# EAGLE design yacc2buss (EAGLE 7.6.0)
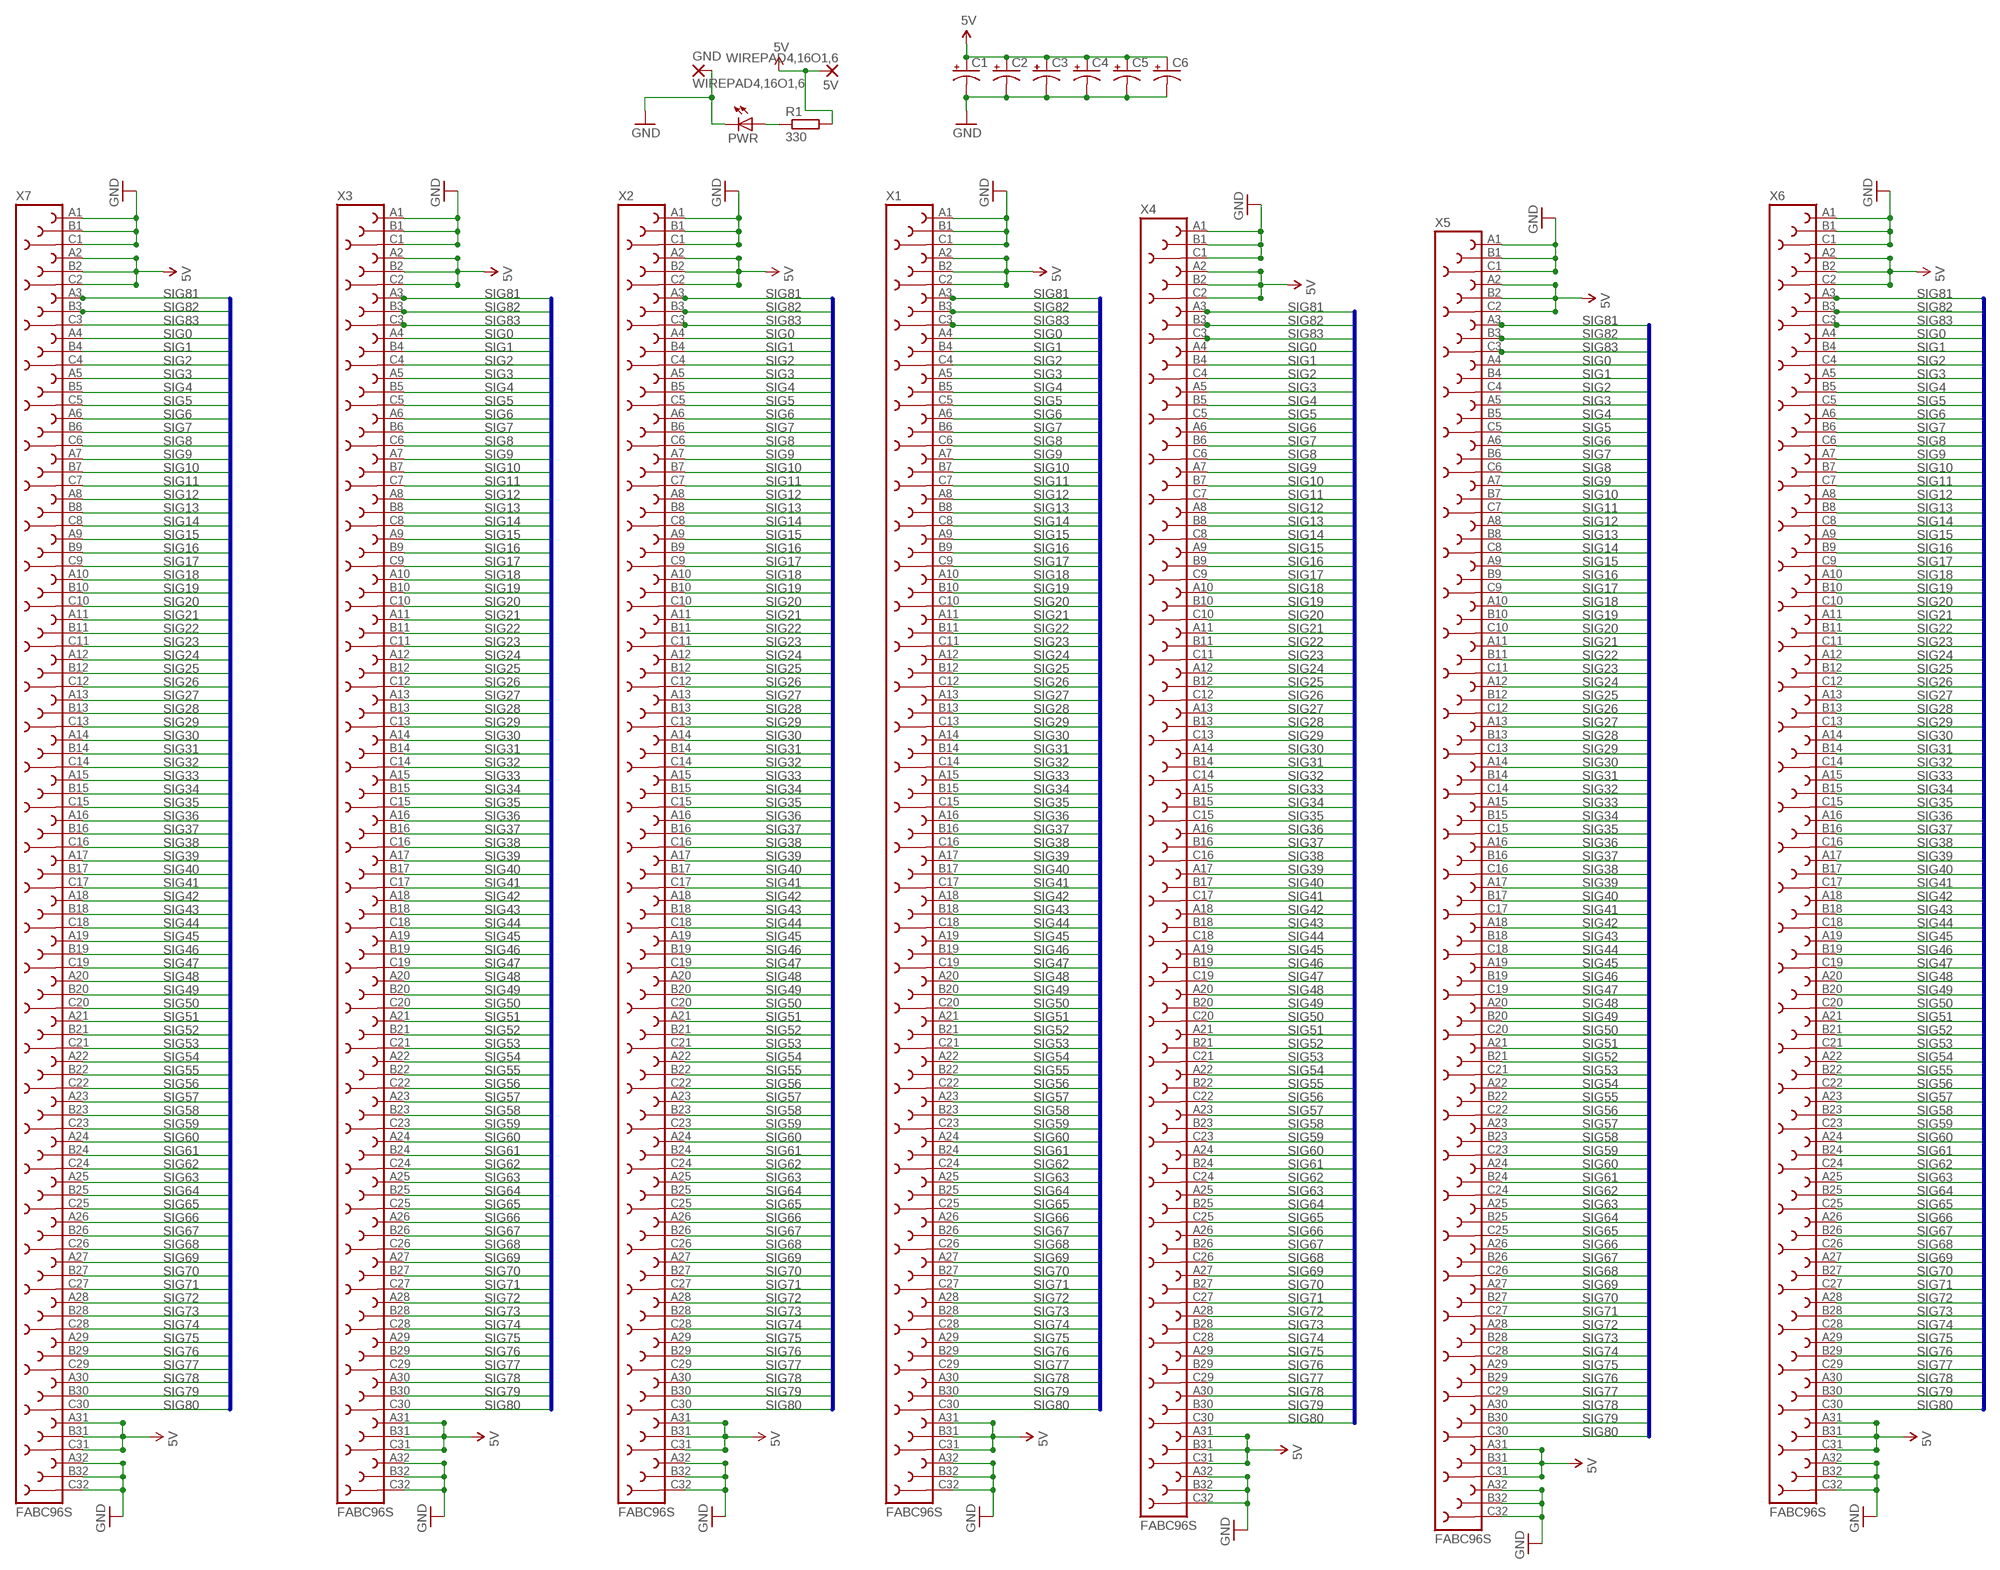
[diagram p0: schematic, sheet 1]

## Parts
5V  WIREPAD4,16O1,6  [4,16O1,6]
C1  CPOL-USE5-6  [E5-6]
C2  CPOL-USE5-6  [E5-6]
C3  CPOL-USE5-6  [E5-6]
C4  CPOL-USE5-6  [E5-6]
C5  CPOL-USE5-6  [E5-6]
C6  CPOL-USE5-6  [E5-6]
GND  WIREPAD4,16O1,6  [4,16O1,6]
PWR  LED5MM  [LED5MM]
R1  330  R0207/10  [0207/10]
X1  FABC96S  [FABC96S]
X2  FABC96S  [FABC96S]
X3  FABC96S  [FABC96S]
X4  FABC96S  [FABC96S]
X5  FABC96S  [FABC96S]
X6  FABC96S  [FABC96S]
X7  FABC96S  [FABC96S]

## Nets
5V [5V]: 5V.1(P) C1.+ C2.+ C3.+ C4.+ C5.+ C6.+ R1.2 X1.A2 X1.A31 X1.B2 X1.B31 X1.C2 X1.C31 X2.A2 X2.A31 X2.B2 X2.B31 X2.C2 X2.C31 X3.A2 X3.A31 X3.B2 X3.B31 X3.C2 X3.C31 X4.A2 X4.A31 X4.B2 X4.B31 X4.C2 X4.C31 X5.A2 X5.A31 X5.B2 X5.B31 X5.C2 X5.C31 X6.A2 X6.A31 X6.B2 X6.B31 X6.C2 X6.C31 X7.A2 X7.A31 X7.B2 X7.B31 X7.C2 X7.C31
GND [GND]: C1.- C2.- C3.- C4.- C5.- C6.- GND.1(P) PWR.K(C) X1.A1 X1.A32 X1.B1 X1.B32 X1.C1 X1.C32 X2.A1 X2.A32 X2.B1 X2.B32 X2.C1 X2.C32 X3.A1 X3.A32 X3.B1 X3.B32 X3.C1 X3.C32 X4.A1 X4.A32 X4.B1 X4.B32 X4.C1 X4.C32 X5.A1 X5.A32 X5.B1 X5.B32 X5.C1 X5.C32 X6.A1 X6.A32 X6.B1 X6.B32 X6.C1 X6.C32 X7.A1 X7.A32 X7.B1 X7.B32 X7.C1 X7.C32
N$2: PWR.A R1.1
SIG0: X1.A4 X2.A4 X3.A4 X4.A4 X5.A4 X6.A4 X7.A4
SIG1: X1.B4 X2.B4 X3.B4 X4.B4 X5.B4 X6.B4 X7.B4
SIG2: X1.C4 X2.C4 X3.C4 X4.C4 X5.C4 X6.C4 X7.C4
SIG3: X1.A5 X2.A5 X3.A5 X4.A5 X5.A5 X6.A5 X7.A5
SIG4: X1.B5 X2.B5 X3.B5 X4.B5 X5.B5 X6.B5 X7.B5
SIG5: X1.C5 X2.C5 X3.C5 X4.C5 X5.C5 X6.C5 X7.C5
SIG6: X1.A6 X2.A6 X3.A6 X4.A6 X5.A6 X6.A6 X7.A6
SIG7: X1.B6 X2.B6 X3.B6 X4.B6 X5.B6 X6.B6 X7.B6
SIG8: X1.C6 X2.C6 X3.C6 X4.C6 X5.C6 X6.C6 X7.C6
SIG9: X1.A7 X2.A7 X3.A7 X4.A7 X5.A7 X6.A7 X7.A7
SIG10: X1.B7 X2.B7 X3.B7 X4.B7 X5.B7 X6.B7 X7.B7
SIG11: X1.C7 X2.C7 X3.C7 X4.C7 X5.C7 X6.C7 X7.C7
SIG12: X1.A8 X2.A8 X3.A8 X4.A8 X5.A8 X6.A8 X7.A8
SIG13: X1.B8 X2.B8 X3.B8 X4.B8 X5.B8 X6.B8 X7.B8
SIG14: X1.C8 X2.C8 X3.C8 X4.C8 X5.C8 X6.C8 X7.C8
SIG15: X1.A9 X2.A9 X3.A9 X4.A9 X5.A9 X6.A9 X7.A9
SIG16: X1.B9 X2.B9 X3.B9 X4.B9 X5.B9 X6.B9 X7.B9
SIG17: X1.C9 X2.C9 X3.C9 X4.C9 X5.C9 X6.C9 X7.C9
SIG18: X1.A10 X2.A10 X3.A10 X4.A10 X5.A10 X6.A10 X7.A10
SIG19: X1.B10 X2.B10 X3.B10 X4.B10 X5.B10 X6.B10 X7.B10
SIG20: X1.C10 X2.C10 X3.C10 X4.C10 X5.C10 X6.C10 X7.C10
SIG21: X1.A11 X2.A11 X3.A11 X4.A11 X5.A11 X6.A11 X7.A11
SIG22: X1.B11 X2.B11 X3.B11 X4.B11 X5.B11 X6.B11 X7.B11
SIG23: X1.C11 X2.C11 X3.C11 X4.C11 X5.C11 X6.C11 X7.C11
SIG24: X1.A12 X2.A12 X3.A12 X4.A12 X5.A12 X6.A12 X7.A12
SIG25: X1.B12 X2.B12 X3.B12 X4.B12 X5.B12 X6.B12 X7.B12
SIG26: X1.C12 X2.C12 X3.C12 X4.C12 X5.C12 X6.C12 X7.C12
SIG27: X1.A13 X2.A13 X3.A13 X4.A13 X5.A13 X6.A13 X7.A13
SIG28: X1.B13 X2.B13 X3.B13 X4.B13 X5.B13 X6.B13 X7.B13
SIG29: X1.C13 X2.C13 X3.C13 X4.C13 X5.C13 X6.C13 X7.C13
SIG30: X1.A14 X2.A14 X3.A14 X4.A14 X5.A14 X6.A14 X7.A14
SIG31: X1.B14 X2.B14 X3.B14 X4.B14 X5.B14 X6.B14 X7.B14
SIG32: X1.C14 X2.C14 X3.C14 X4.C14 X5.C14 X6.C14 X7.C14
SIG33: X1.A15 X2.A15 X3.A15 X4.A15 X5.A15 X6.A15 X7.A15
SIG34: X1.B15 X2.B15 X3.B15 X4.B15 X5.B15 X6.B15 X7.B15
SIG35: X1.C15 X2.C15 X3.C15 X4.C15 X5.C15 X6.C15 X7.C15
SIG36: X1.A16 X2.A16 X3.A16 X4.A16 X5.A16 X6.A16 X7.A16
SIG37: X1.B16 X2.B16 X3.B16 X4.B16 X5.B16 X6.B16 X7.B16
SIG38: X1.C16 X2.C16 X3.C16 X4.C16 X5.C16 X6.C16 X7.C16
SIG39: X1.A17 X2.A17 X3.A17 X4.A17 X5.A17 X6.A17 X7.A17
SIG40: X1.B17 X2.B17 X3.B17 X4.B17 X5.B17 X6.B17 X7.B17
SIG41: X1.C17 X2.C17 X3.C17 X4.C17 X5.C17 X6.C17 X7.C17
SIG42: X1.A18 X2.A18 X3.A18 X4.A18 X5.A18 X6.A18 X7.A18
SIG43: X1.B18 X2.B18 X3.B18 X4.B18 X5.B18 X6.B18 X7.B18
SIG44: X1.C18 X2.C18 X3.C18 X4.C18 X5.C18 X6.C18 X7.C18
SIG45: X1.A19 X2.A19 X3.A19 X4.A19 X5.A19 X6.A19 X7.A19
SIG46: X1.B19 X2.B19 X3.B19 X4.B19 X5.B19 X6.B19 X7.B19
SIG47: X1.C19 X2.C19 X3.C19 X4.C19 X5.C19 X6.C19 X7.C19
SIG48: X1.A20 X2.A20 X3.A20 X4.A20 X5.A20 X6.A20 X7.A20
SIG49: X1.B20 X2.B20 X3.B20 X4.B20 X5.B20 X6.B20 X7.B20
SIG50: X1.C20 X2.C20 X3.C20 X4.C20 X5.C20 X6.C20 X7.C20
SIG51: X1.A21 X2.A21 X3.A21 X4.A21 X5.A21 X6.A21 X7.A21
SIG52: X1.B21 X2.B21 X3.B21 X4.B21 X5.B21 X6.B21 X7.B21
SIG53: X1.C21 X2.C21 X3.C21 X4.C21 X5.C21 X6.C21 X7.C21
SIG54: X1.A22 X2.A22 X3.A22 X4.A22 X5.A22 X6.A22 X7.A22
SIG55: X1.B22 X2.B22 X3.B22 X4.B22 X5.B22 X6.B22 X7.B22
SIG56: X1.C22 X2.C22 X3.C22 X4.C22 X5.C22 X6.C22 X7.C22
SIG57: X1.A23 X2.A23 X3.A23 X4.A23 X5.A23 X6.A23 X7.A23
SIG58: X1.B23 X2.B23 X3.B23 X4.B23 X5.B23 X6.B23 X7.B23
SIG59: X1.C23 X2.C23 X3.C23 X4.C23 X5.C23 X6.C23 X7.C23
SIG60: X1.A24 X2.A24 X3.A24 X4.A24 X5.A24 X6.A24 X7.A24
SIG61: X1.B24 X2.B24 X3.B24 X4.B24 X5.B24 X6.B24 X7.B24
SIG62: X1.C24 X2.C24 X3.C24 X4.C24 X5.C24 X6.C24 X7.C24
SIG63: X1.A25 X2.A25 X3.A25 X4.A25 X5.A25 X6.A25 X7.A25
SIG64: X1.B25 X2.B25 X3.B25 X4.B25 X5.B25 X6.B25 X7.B25
SIG65: X1.C25 X2.C25 X3.C25 X4.C25 X5.C25 X6.C25 X7.C25
SIG66: X1.A26 X2.A26 X3.A26 X4.A26 X5.A26 X6.A26 X7.A26
SIG67: X1.B26 X2.B26 X3.B26 X4.B26 X5.B26 X6.B26 X7.B26
SIG68: X1.C26 X2.C26 X3.C26 X4.C26 X5.C26 X6.C26 X7.C26
SIG69: X1.A27 X2.A27 X3.A27 X4.A27 X5.A27 X6.A27 X7.A27
SIG70: X1.B27 X2.B27 X3.B27 X4.B27 X5.B27 X6.B27 X7.B27
SIG71: X1.C27 X2.C27 X3.C27 X4.C27 X5.C27 X6.C27 X7.C27
SIG72: X1.A28 X2.A28 X3.A28 X4.A28 X5.A28 X6.A28 X7.A28
SIG73: X1.B28 X2.B28 X3.B28 X4.B28 X5.B28 X6.B28 X7.B28
SIG74: X1.C28 X2.C28 X3.C28 X4.C28 X5.C28 X6.C28 X7.C28
SIG75: X1.A29 X2.A29 X3.A29 X4.A29 X5.A29 X6.A29 X7.A29
SIG76: X1.B29 X2.B29 X3.B29 X4.B29 X5.B29 X6.B29 X7.B29
SIG77: X1.C29 X2.C29 X3.C29 X4.C29 X5.C29 X6.C29 X7.C29
SIG78: X1.A30 X2.A30 X3.A30 X4.A30 X5.A30 X6.A30 X7.A30
SIG79: X1.B30 X2.B30 X3.B30 X4.B30 X5.B30 X6.B30 X7.B30
SIG80: X1.C30 X2.C30 X3.C30 X4.C30 X5.C30 X6.C30 X7.C30
SIG81: X1.A3 X2.A3 X3.A3 X4.A3 X5.A3 X6.A3 X7.A3
SIG82: X1.B3 X2.B3 X3.B3 X4.B3 X5.B3 X6.B3 X7.B3
SIG83: X1.C3 X2.C3 X3.C3 X4.C3 X5.C3 X6.C3 X7.C3

## Buses
SIG[0..83]

## Library data of the parts
5V GND = wirepad:WIREPAD: Wire PAD connect wire on PCB
C1-C6 = rcl:CPOL-US: POLARIZED CAPACITOR, American symbol
PWR = led:LED: LED OSRAM: - CHIPLED LG R971, LG N971, LY N971, LG Q971, LY Q971, LO R971, LY R971 LH N974, LH R974 LS Q976, LO Q976, LY Q976 LO Q996 - Hyper CHIPLED LW Q18S LB Q993, LB Q99A, LB R99A - SideLED LS A670, LO A670, LY A670, LG A670, LP A670 LB A673, LV A673, LT A673, LW A673 LH A674 LY A675 LS A676, LA A676, LO A676, LY A676, LW A676 LS A679, LY A679, LG A679 - Hyper Micro SIDELED® LS Y876, LA Y876, LO Y876, LY Y876 LT Y87S - SmartLED LW L88C, LW L88S LB L89C, LB L89S, LG L890 LS L89K, LO L89K, LY L89K LS L896, LA L896, LO L896, LY L896 - TOPLED LS T670, LO T670, LY T670, LG T670, LP T670 LSG T670, LSP T670, LSY T670, LOP T670, LYG T670 LG T671, LOG T671, LSG T671 LB T673, LV T673, LT T673, LW T673 LH T674 LS T676, LA T676, LO T676, LY T676, LB T676, LH T676, LSB T676, LW T676 LB T67C, LV T67C, LT T67C, LS T67K, LO T67K, LY T67K, LW E67C LS E67B, LA E67B, LO E67B, LY E67B, LB E67C, LV E67C, LT E67C LW T67C LS T679, LY T679, LG T679 LS T770, LO T770, LY T770, LG T770, LP T770 LB T773, LV T773, LT T773, LW T773 LH T774 LS E675, LA E675, LY E675, LS T675 LS T776, LA T776, LO T776, LY T776, LB T776 LHGB T686 LT T68C, LB T68C - Hyper Mini TOPLED® LB M676 - Mini TOPLED Santana® LG M470 LS M47K, LO M47K, LY M47K Source: http://www.osram.convergy.de LUXEON: - LUMILED® LXK2-PW12-R00, LXK2-PW12-S00, LXK2-PW14-U00, LXK2-PW14-V00 LXK2-PM12-R00, LXK2-PM12-S00, LXK2-PM14-U00 LXK2-PE12-Q00, LXK2-PE12-R00, LXK2-PE12-S00, LXK2-PE14-T00, LXK2-PE14-U00 LXK2-PB12-K00, LXK2-PB12-L00, LXK2-PB12-M00, LXK2-PB14-N00, LXK2-PB14-P00, LXK2-PB14-Q00 LXK2-PR12-L00, LXK2-PR12-M00, LXK2-PR14-Q00, LXK2-PR14-R00 LXK2-PD12-Q00, LXK2-PD12-R00, LXK2-PD12-S00 LXK2-PH12-R00, LXK2-PH12-S00 LXK2-PL12-P00, LXK2-PL12-Q00, LXK2-PL12-R00 Source: www.luxeon.com KINGBRIGHT: KA-3528ASYC Source: www.kingbright.com
R1 = eagle-ltspice:R: RESISTOR, European symbol; SPICEMODEL: NONE; SPICEPREFIX: R
X1-X7 = con-vg:FABC96S: CONNECTOR female, 96 pins, block, type C, rows ABC, grid 2.54 mm

## Net classes
1 GND: width 1 mm
2 5V: width 1 mm
3 12V: width 1 mm

## Board
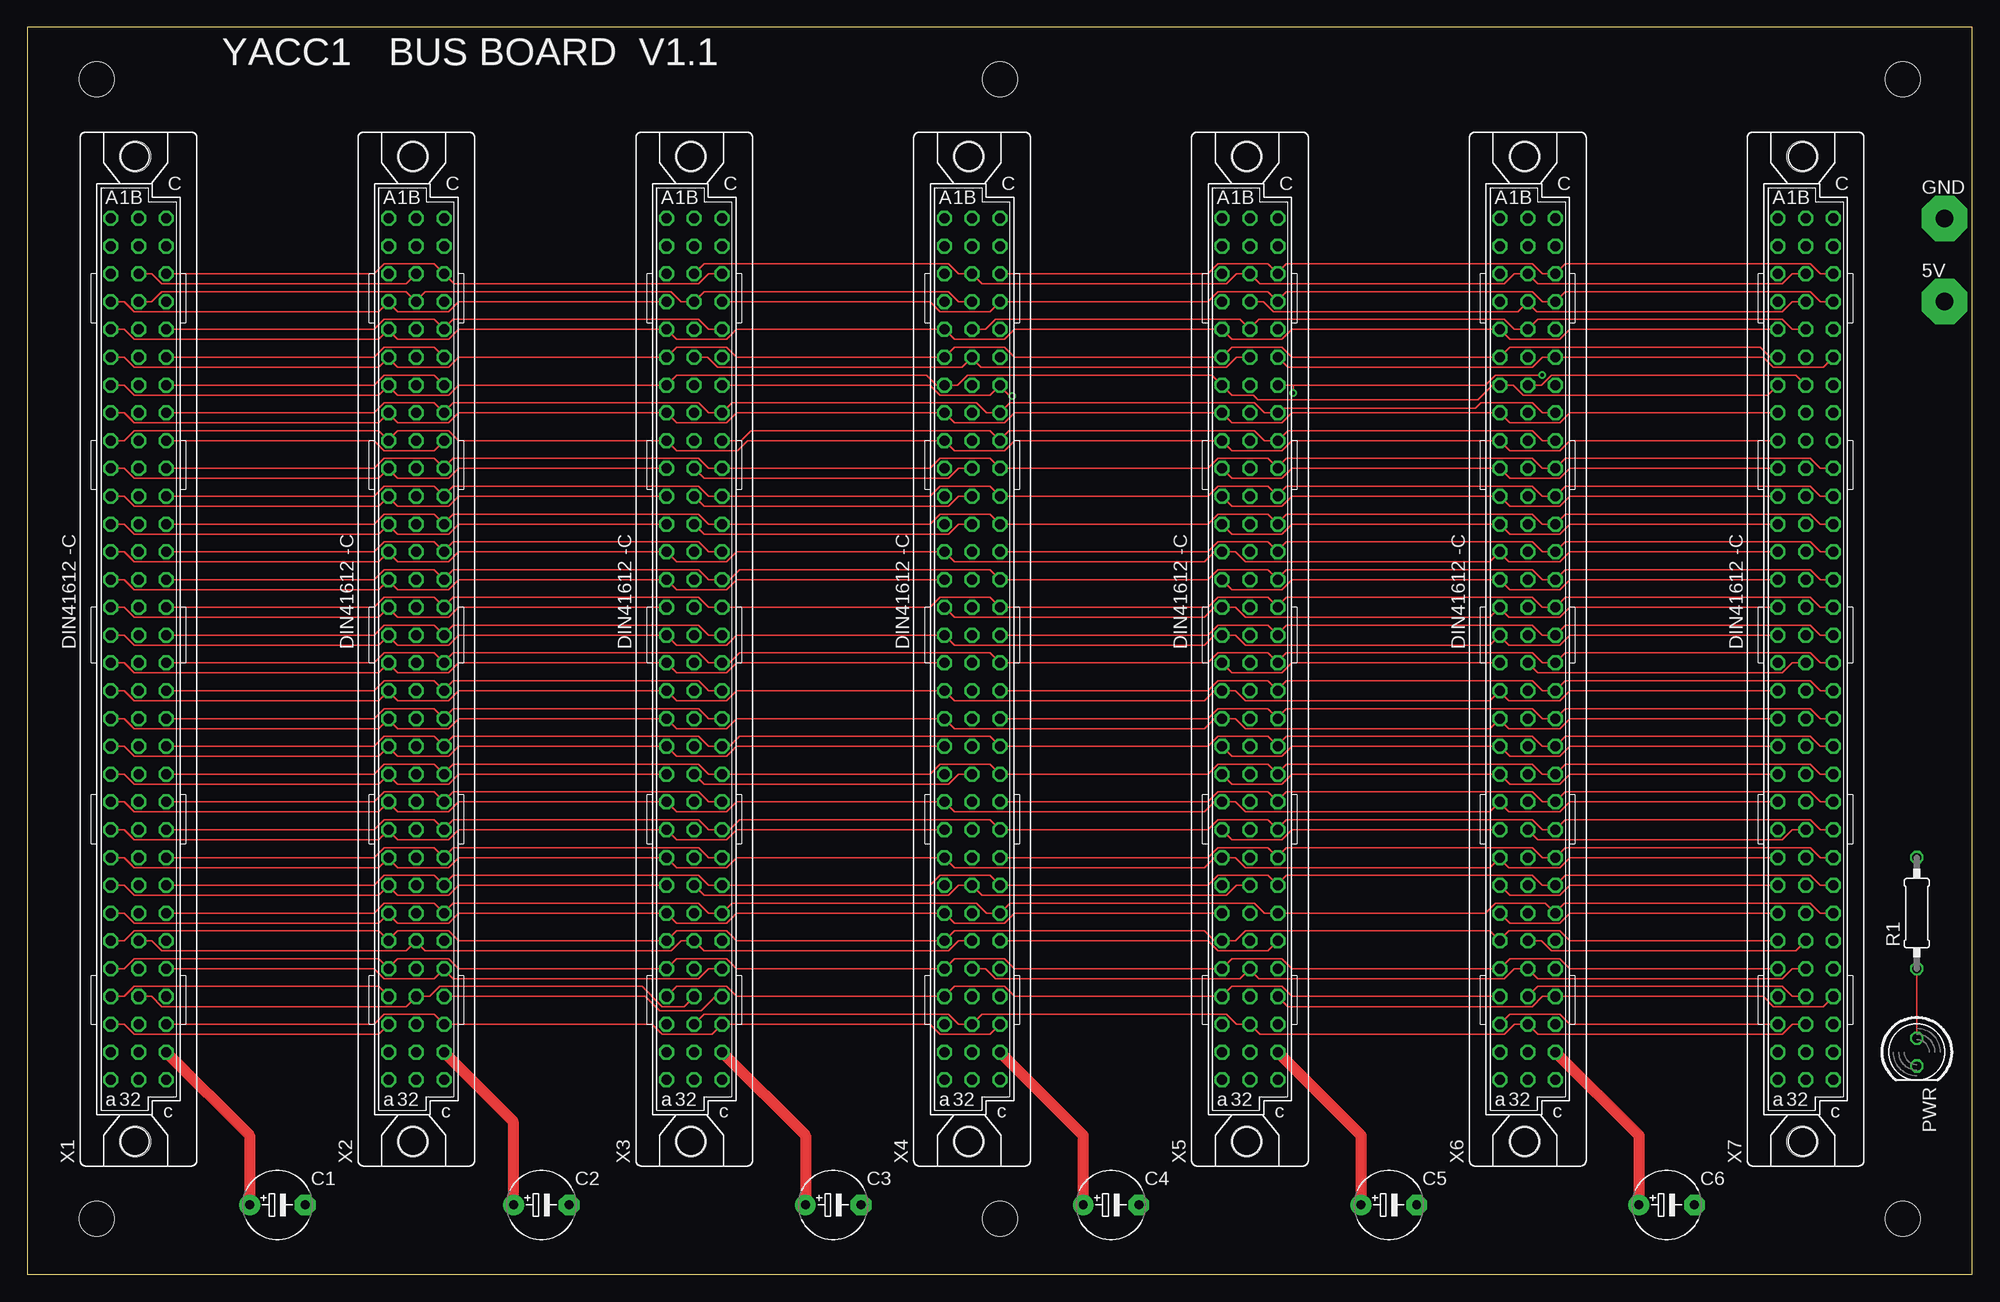
[diagram p1: board, top side]
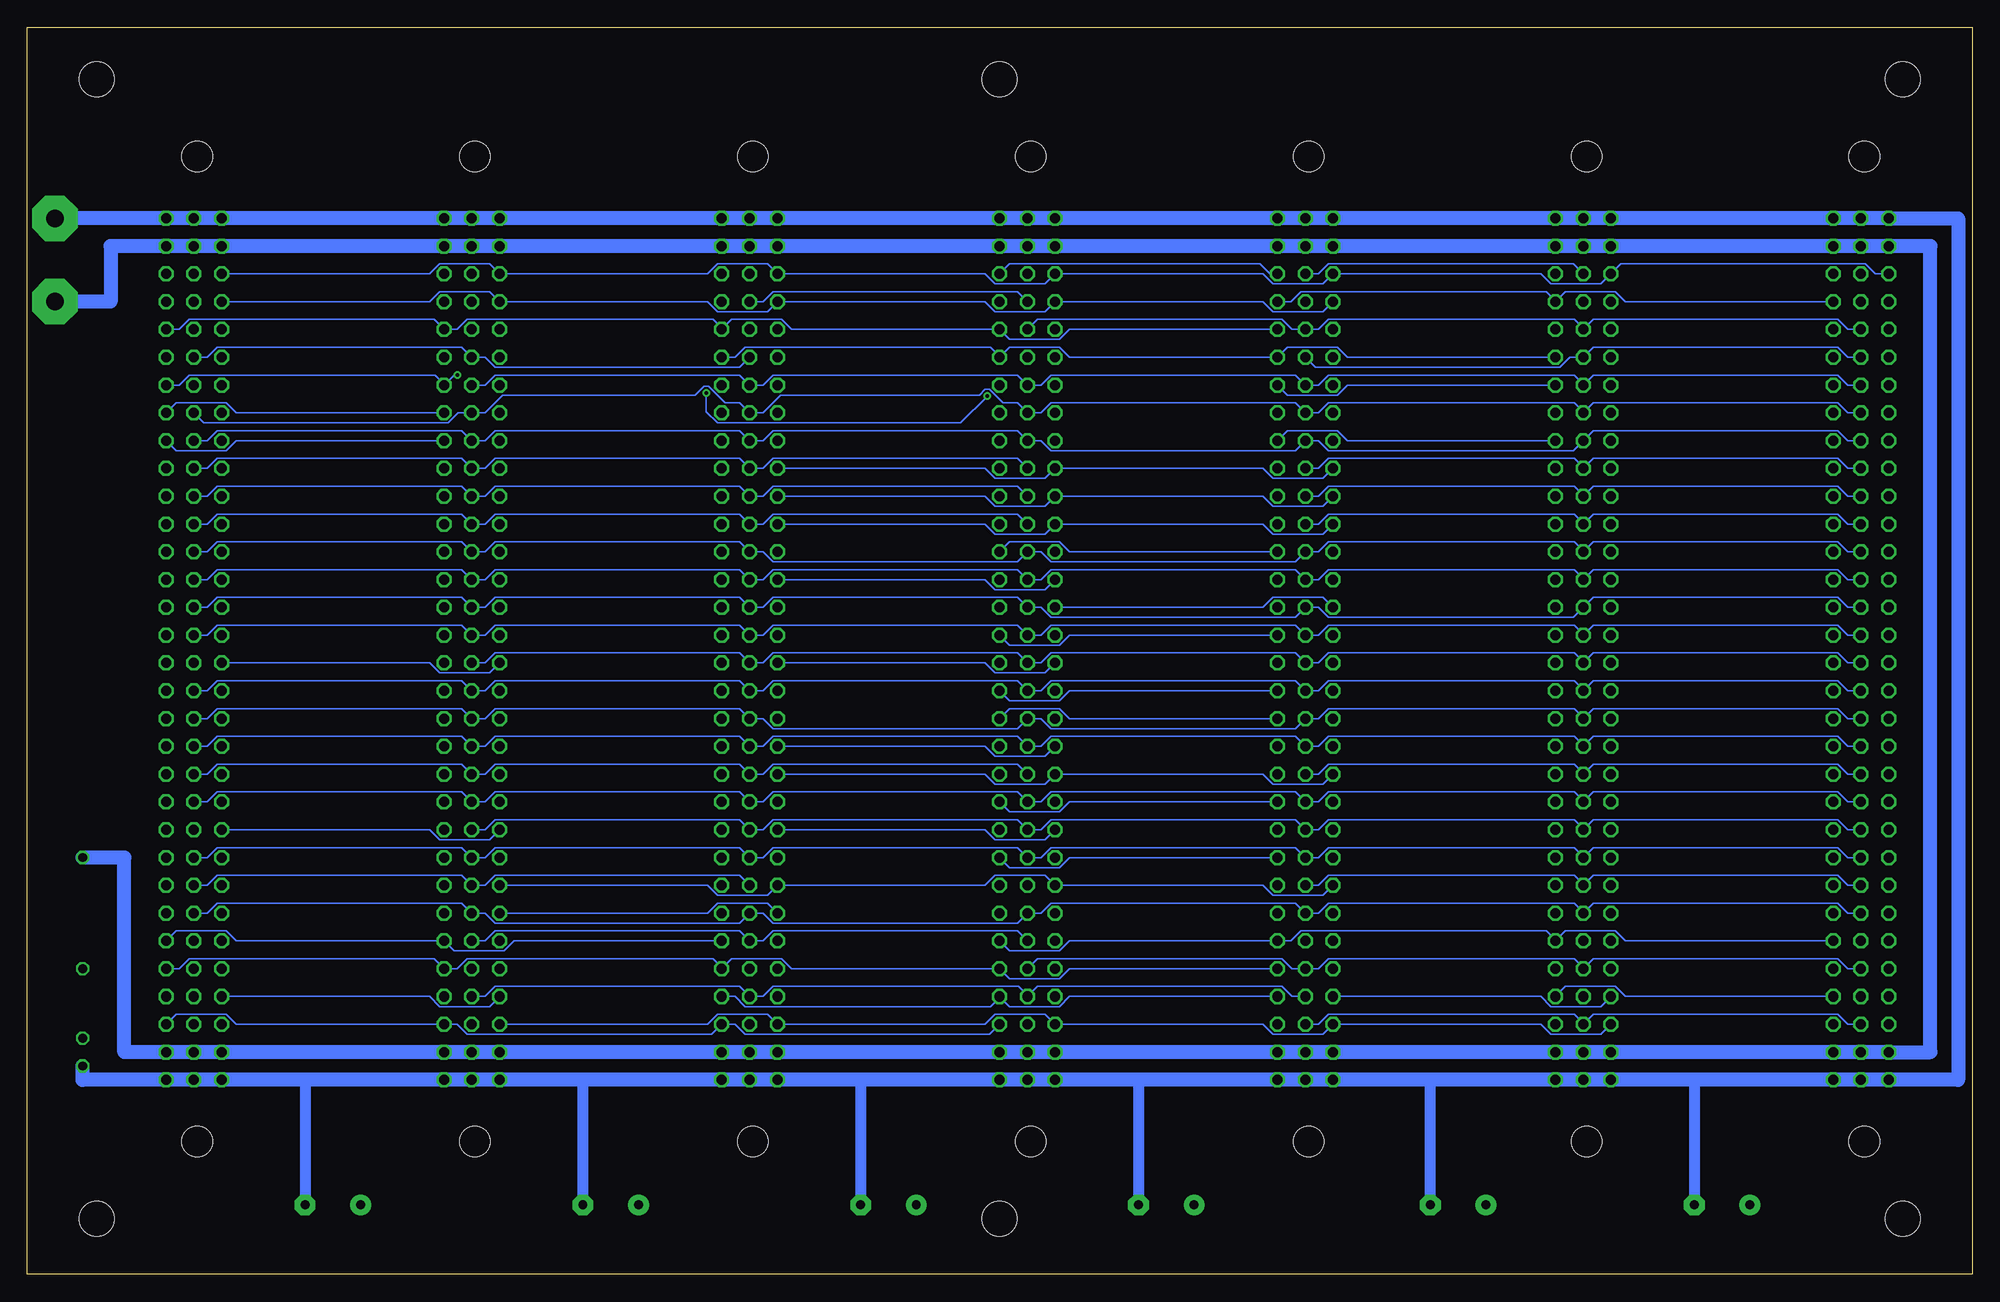
[diagram p2: board, bottom side, seen from below]

Size 177.78 x 113.97 mm. Coordinates in mm from the lower left corner, seen from the top.
Outline: 0,0 177.78,0 177.78,113.97 0,113.97 0,0
Copper layers (1*16): Top 0.0356mm / dielectric 1.5011mm / Bottom 0.0356mm
Design rules "LaenPCBOrder *": minimum track width 6mil, minimum drill 13mil, track to track 10mil, track to pad 6mil, pad to pad 6mil, via to via 6mil, smd to smd 6mil, copper to edge 15mil, drill to drill 6mil, minimum pad ring 7mil, minimum via ring 7mil, stop-mask expansion 3mil, vias tented up to drill 0mil, thermal gap 10mil
Holes 3.2 mm at 6.35,109.22 88.9,109.22 171.45,109.22 6.35,5.08 88.9,5.08 171.45,5.08
tKeepout: area 172.7,77.5 to 177.8,91.4
tRestrict: area 166.4,90.2 to 176.5,97.8; area 167.6,81.3 to 172.7,94; area 5.1,92.7 to 166.4,97.8

### Footprints (pad centres in the part's own frame; a part is rotated, then mirrored left to right if it is on the bottom)
4,16O1,6 = drill 1.6 pad 4.166 octagon: 1 0,0
E5-6 = drill 0.813 pad 1.905: + -2.54,0 | drill 0.813 pad 1.905 octagon: - 2.54,0
LED5MM = drill 0.813 octagon: A -1.27,0; K 1.27,0
0207/10 = drill 0.813 octagon: 1 -5.08,0; 2 5.08,0
FABC96S = drill 0.914 octagon: A1 -2.54,39.37; A2 -2.54,36.83; A3 -2.54,34.29; A4 -2.54,31.75; A5 -2.54,29.21; A6 -2.54,26.67; A7 -2.54,24.13; A8 -2.54,21.59; A9 -2.54,19.05; A10 -2.54,16.51; A11 -2.54,13.97; A12 -2.54,11.43; A13 -2.54,8.89; A14 -2.54,6.35; A15 -2.54,3.81; A16 -2.54,1.27; A17 -2.54,-1.27; A18 -2.54,-3.81; A19 -2.54,-6.35; A20 -2.54,-8.89; A21 -2.54,-11.43; A22 -2.54,-13.97; A23 -2.54,-16.51; A24 -2.54,-19.05; A25 -2.54,-21.59; A26 -2.54,-24.13; A27 -2.54,-26.67; A28 -2.54,-29.21; A29 -2.54,-31.75; A30 -2.54,-34.29; A31 -2.54,-36.83; A32 -2.54,-39.37; B1 0,39.37; B2 0,36.83; B3 0,34.29; B4 0,31.75; B5 0,29.21; B6 0,26.67; B7 0,24.13; B8 0,21.59; B9 0,19.05; B10 0,16.51; B11 0,13.97; B12 0,11.43; B13 0,8.89; B14 0,6.35; B15 0,3.81; B16 0,1.27; B17 0,-1.27; B18 0,-3.81; B19 0,-6.35; B20 0,-8.89; B21 0,-11.43; B22 0,-13.97; B23 0,-16.51; B24 0,-19.05; B25 0,-21.59; B26 0,-24.13; B27 0,-26.67; B28 0,-29.21; B29 0,-31.75; B30 0,-34.29; B31 0,-36.83; B32 0,-39.37; C1 2.54,39.37; C2 2.54,36.83; C3 2.54,34.29; C4 2.54,31.75; C5 2.54,29.21; C6 2.54,26.67; C7 2.54,24.13; C8 2.54,21.59; C9 2.54,19.05; C10 2.54,16.51; C11 2.54,13.97; C12 2.54,11.43; C13 2.54,8.89; C14 2.54,6.35; C15 2.54,3.81; C16 2.54,1.27; C17 2.54,-1.27; C18 2.54,-3.81; C19 2.54,-6.35; C20 2.54,-8.89; C21 2.54,-11.43; C22 2.54,-13.97; C23 2.54,-16.51; C24 2.54,-19.05; C25 2.54,-21.59; C26 2.54,-24.13; C27 2.54,-26.67; C28 2.54,-29.21; C29 2.54,-31.75; C30 2.54,-34.29; C31 2.54,-36.83; C32 2.54,-39.37 | hole 2.794: -0.305,45.009; -0.305,-45.009

### Placement (x,y rotation side)
5V  175.26,88.9 0 top
C1  22.86,6.35 0 top
C2  46.99,6.35 0 top
C3  73.66,6.35 0 top
C4  99.06,6.35 0 top
C5  124.46,6.35 0 top
C6  149.86,6.35 0 top
GND  175.26,96.52 0 top
PWR  172.72,20.32 270 top
R1  172.72,33.02 90 top
X1  10.16,57.15 0 top
X2  35.56,57.15 0 top
X3  60.96,57.15 0 top
X4  86.36,57.15 0 top
X5  111.76,57.15 0 top
X6  137.16,57.15 0 top
X7  162.56,57.15 0 top

### Tracks (layer width: path | path; a pad name or v marks a point on that pad's centre or on a via)
5V
  Top 1: C1.+ 20.32,12.7 X1.C31 | X2.C31 44.4,14.02 44.4,6.4 C2.+ | C3.+ 71.12,12.7 X3.C31 | C4.+ 96.52,12.7 X4.C31 | C5.+ 121.92,12.7 X5.C31 | C6.+ 147.32,12.7 X6.C31
  Bottom 1.27: R1.2 168.91,38.1 168.91,20.32 X7.C31 X7.B31 X7.A31 X6.C31 X6.B31 X6.A31 X5.C31 X5.B31 X5.A31 X4.C31 X4.B31 X4.A31 X3.C31 X3.B31 X3.A31 X2.C31 X2.B31 X2.A31 X1.C31 X1.B31 X1.A31 3.81,20.32 3.81,93.98 X1.A2 X1.B2 X1.C2 X2.A2 X2.B2 X2.C2 X3.A2 X3.B2 X3.C2 X4.A2 X4.B2 X4.C2 X5.A2 X5.B2 X5.C2 X6.A2 X6.B2 X6.C2 X7.A2 X7.B2 X7.C2 170.18,93.98 170.18,88.9 5V.1
GND
  Bottom 1: 25.4,17.78 C1.- | 49.58,17.78 49.58,6.4 C2.- | 76.2,17.78 C3.- | 101.6,17.78 C4.- | 127,17.78 C5.- | 152.4,17.78 C6.- | 173.99,96.52 GND.1
  Bottom 1.27: PWR.K 172.72,17.78 X7.C32 X7.B32 X7.A32 152.4,17.78 X6.C32 X6.B32 X6.A32 127,17.78 X5.C32 X5.B32 X5.A32 101.6,17.78 X4.C32 X4.B32 X4.A32 76.2,17.78 X3.C32 X3.B32 X3.A32 49.58,17.78 X2.C32 X2.B32 X2.A32 25.4,17.78 X1.C32 X1.B32 X1.A32 1.27,17.78 1.27,96.52 X1.A1 X1.B1 X1.C1 X2.A1 X2.B1 X2.C1 X3.A1 X3.B1 X3.C1 X4.A1 X4.B1 X4.C1 X5.A1 X5.B1 X5.C1 X6.A1 X6.B1 X6.C1 X7.A1 X7.B1 X7.C1 173.99,96.52
N$2
  Top 0.152: R1.1 PWR.A
SIG0
  Top 0.152: X1.A4 8.84,88.9 9.75,87.99 32.11,87.99 X2.A4 33.02,88.8 33.83,87.99 38.51,87.99 39.42,88.9 X3.A4
  Bottom 0.152: X3.A4 59.33,87.99 63.91,87.99 64.82,88.9 X4.A4 84.73,87.99 89.31,87.99 90.22,88.9 X5.A4 110.13,87.99 114.71,87.99 115.62,88.9 X6.A4 135.53,89.81 140.11,89.81 141.02,88.9 X7.A4
SIG1
  Top 0.152: X5.B4 112.98,88.9 113.89,87.99 136.25,87.99 X6.B4 137.16,88.8 137.97,87.99 160.43,87.99 161.34,88.9 X7.B4 | X1.B4 11.38,88.9 12.29,89.81 34.65,89.81 X2.B4 35.56,89 36.37,89.81 58.83,89.81 59.74,88.9 X3.B4 61.87,89.81 84.23,89.81 85.14,88.9 X4.B4
  Bottom 0.152: X5.B4 110.54,88.9 109.63,89.81 87.27,89.81 X4.B4
SIG2
  Top 0.152: X7.C4 163.88,88.9 162.97,89.81 140.61,89.81 X6.C4 138.48,88.9 137.57,89.81 115.11,89.81 114.3,89 X5.C4 113.39,89.81 108.81,89.81 107.9,88.9 X4.C4 87.99,87.99 83.41,87.99 82.5,88.9 X3.C4
  Bottom 0.152: X1.C4 31.7,88.9 32.61,89.81 37.19,89.81 X2.C4 38.1,89 38.91,89.81 61.37,89.81 62.28,88.9 X3.C4
SIG3
  Top 0.152: X1.A5 8.84,86.36 9.75,85.45 32.11,85.45 X2.A5 33.02,86.26 33.83,85.45 38.51,85.45 39.42,86.36 X3.A5 59.33,85.45 63.91,85.45 64.82,86.36 X4.A5 84.73,85.45 89.31,85.45 90.22,86.36 X5.A5 110.13,85.45 114.71,85.45 115.62,86.36 X6.A5 135.53,85.45 140.11,85.45 141.02,86.36 X7.A5
SIG4
  Top 0.152: X4.B5 87.58,86.36 88.49,87.27 110.85,87.27 X5.B5 111.76,86.46 112.57,87.27 135.03,87.27 135.94,86.36 X6.B5 138.07,87.27 160.43,87.27 161.34,86.36 X7.B5
  Bottom 0.152: X1.B5 11.38,86.36 12.29,87.27 34.65,87.27 X2.B5 35.56,86.46 36.37,87.27 58.83,87.27 59.74,86.36 X3.B5 62.18,86.36 63.09,87.27 85.45,87.27 X4.B5
SIG5
  Top 0.152: X1.C5 31.7,86.36 32.61,87.27 37.19,87.27 X2.C5 38.1,86.46 38.91,87.27 61.37,87.27 62.28,86.36 X3.C5
  Bottom 0.152: X7.C5 163.88,86.36 162.97,87.27 140.61,87.27 X6.C5 138.48,86.36 137.57,87.27 115.11,87.27 114.3,86.46 X5.C5 113.39,87.27 108.81,87.27 107.9,86.36 X4.C5 87.99,85.45 83.41,85.45 82.5,86.36 X3.C5
SIG6
  Top 0.152: X1.A6 8.84,83.82 9.75,82.91 32.11,82.91 X2.A6 33.02,83.72 33.83,82.91 38.51,82.91 39.42,83.82 X3.A6 59.33,84.73 63.91,84.73 64.82,83.82 X4.A6 84.73,84.73 89.31,84.73 90.22,83.82 X5.A6 110.13,84.73 114.71,84.73 115.62,83.82 X6.A6 135.53,84.73 158.39,84.73 159.31,83.82 X7.A6
SIG7
  Top 0.152: X3.B6 62.18,83.82 63.09,82.91 85.45,82.91 X4.B6 86.36,83.72 87.17,82.91 109.63,82.91 110.54,83.82 X5.B6
  Bottom 0.152: X1.B6 11.38,83.82 12.29,84.73 34.65,84.73 X2.B6 36.78,83.82 37.69,82.91 60.05,82.91 X3.B6 | X5.B6 112.67,82.91 135.03,82.91 135.94,83.82 X6.B6 138.07,84.73 160.43,84.73 161.34,83.82 X7.B6
SIG8
  Top 0.152: X7.C6 164.19,82.91 159.61,82.91 158.7,83.82 X6.C6 138.48,83.82 137.57,82.91 115.21,82.91 X5.C6 | X1.C6 31.7,83.82 32.61,84.73 37.19,84.73 X2.C6
  Bottom 0.152: X5.C6 113.08,83.82 112.17,84.73 89.71,84.73 88.9,83.92 X4.C6 87.99,84.73 83.41,84.73 82.5,83.82 X3.C6 62.59,84.73 58.01,84.73 57.1,83.82 X2.C6
SIG9
  Top 0.152: X7.A7 159.11,80.37 136.75,80.37 135.84,81.28 X6.A7 133.91,81.28 132.59,79.96 112.47,79.96 112.06,80.37 110.13,80.37 X5.A7 108.31,82.19 85.95,82.19 85.04,81.28 X4.A7 83.11,81.28 82.19,82.19 59.33,82.19 X3.A7 39.42,81.28 38.51,80.37 33.83,80.37 33.02,81.18 X2.A7 32.11,80.37 9.75,80.37 8.84,81.28 X1.A7
SIG10
  Top 0.152: X6.B7 138.38,81.28 139.29,82.19 161.65,82.19 X7.B7
  Bottom 0.152: X1.B7 11.38,81.28 12.29,82.19 34.65,82.19 X2.B7 35.56,81.38 36.37,82.19 58.83,82.19 59.74,81.28 X3.B7 61.87,82.19 84.23,82.19 85.14,81.28 X4.B7 87.27,82.19 109.63,82.19 110.54,81.28 X5.B7 112.67,82.19 135.03,82.19 135.94,81.28 X6.B7
SIG11  (via drill 0.33)
  Top 0.152: 115.72,81.28 133.3,81.28 134.21,82.19 v138.48,82.19 | 115.72,81.28 X5.C7 | X1.C7 31.7,81.28 32.61,82.19 37.19,82.19 X2.C7 | X3.C7 82.5,81.28 83.41,80.37 87.99,80.37 X4.C7 88.9,81.18 89.81,80.26 v90.02,80.26 | v115.72,80.57 115.72,81.28
  Bottom 0.152: v138.48,82.19 138.79,82.19 X6.C7 139.7,81.38 140.51,82.19 162.97,82.19 163.88,81.28 X7.C7 | X2.C7 57.1,81.28 58.01,80.37 62.59,80.37 X3.C7 | v115.72,80.57 115.72,78.84 114.71,77.83 92.46,77.83 v90.02,80.26
SIG12
  Top 0.152: X1.A8 8.84,78.74 9.75,77.83 32.11,77.83 X2.A8 33.02,78.64 33.83,77.83 38.51,77.83 39.42,78.74 X3.A8 59.33,77.83 63.91,77.83 64.82,78.74 X4.A8 84.73,77.83 89.31,77.83 90.22,78.74 X5.A8 110.13,77.83 114.71,77.83 115.62,78.74 X6.A8 135.53,77.83 140.11,77.83 141.02,78.74 X7.A8
SIG13
  Bottom 0.152: X7.B8 161.65,77.83 139.29,77.83 138.38,78.74 X6.B8 135.94,78.74 134.31,80.37 116.74,80.37 115.93,81.18 115.52,81.18 114,79.65 112.67,79.65 X5.B8 110.54,78.74 108.92,80.37 90.73,80.37 90.22,80.87 89.81,80.87 88.59,79.65 87.27,79.65 X4.B8 85.14,78.74 84.23,79.65 61.87,79.65 X3.B8 59.74,78.74 58.83,79.65 36.37,79.65 35.56,78.84 X2.B8 34.65,79.65 12.29,79.65 11.38,78.74 X1.B8
SIG14
  Top 0.152: X1.C8 31.7,78.74 32.61,79.65 37.19,79.65 X2.C8 38.1,78.84 38.91,79.65 61.37,79.65 62.28,78.74 X3.C8 64.41,79.65 86.77,79.65 87.68,78.74 X4.C8 89.81,79.65 112.17,79.65 113.08,78.74 X5.C8 114.71,79.15 132.38,79.15 132.89,79.65 137.57,79.65 138.48,78.74 X6.C8
  Bottom 0.152: X6.C8 158.7,78.74 159.61,79.65 164.19,79.65 X7.C8
SIG15
  Top 0.152: X1.A9 8.84,76.2 9.75,77.11 32.11,77.11 X2.A9 33.02,76.3 33.83,77.11 38.51,77.11 39.42,76.2 X3.A9 59.33,75.29 64.92,75.29 65.84,76.2 X4.A9 84.73,75.29 89.31,75.29 90.22,76.2 X5.A9 110.13,75.29 114.71,75.29 115.62,76.2 X6.A9 135.53,75.29 140.11,75.29 141.02,76.2 X7.A9
SIG16
  Bottom 0.152: X1.B9 11.38,76.2 12.29,77.11 34.65,77.11 X2.B9 36.47,75.29 58.83,75.29 59.74,76.2 X3.B9 61.87,75.29 84.23,75.29 85.14,76.2 X4.B9 87.27,77.11 109.63,77.11 110.54,76.2 X5.B9 112.67,77.11 135.03,77.11 135.94,76.2 X6.B9 138.07,77.11 160.43,77.11 161.34,76.2 X7.B9
SIG17
  Top 0.152: X1.C9 31.7,76.2 32.61,75.29 37.19,75.29 X2.C9 | X3.C9 65.23,76.2 66.14,77.11 87.99,77.11 X4.C9 88.9,76.3 89.71,77.11 112.17,77.11 113.08,76.2 X5.C9 115.21,77.11 137.57,77.11 138.48,76.2 X6.C9
  Bottom 0.152: X6.C9 158.7,76.2 159.61,75.29 164.19,75.29 X7.C9 | X2.C9 57.1,76.2 58.01,77.11 62.59,77.11 X3.C9
SIG18
  Top 0.152: X1.A10 8.84,73.66 9.75,72.75 32.11,72.75 X2.A10 33.02,73.56 33.83,72.75 38.51,72.75 39.42,73.66 X3.A10 | X5.A10 110.13,72.75 114.71,72.75 115.62,73.66 X6.A10 135.53,72.75 140.11,72.75 141.02,73.66 X7.A10
  Bottom 0.152: X3.A10 59.33,72.75 63.91,72.75 64.82,73.66 X4.A10 84.73,72.75 89.31,72.75 90.22,73.66 X5.A10
SIG19
  Top 0.152: X4.B10 85.14,73.66 84.23,72.75 61.87,72.75 X3.B10
  Bottom 0.152: X1.B10 11.38,73.66 12.29,74.57 34.65,74.57 X2.B10 35.56,73.76 36.37,74.57 58.83,74.57 59.74,73.66 X3.B10 | X4.B10 87.27,74.57 109.63,74.57 110.54,73.66 X5.B10 112.67,74.57 135.03,74.57 135.94,73.66 X6.B10 138.07,74.57 160.43,74.57 161.34,73.66 X7.B10
SIG20
  Top 0.152: X1.C10 31.7,73.66 32.61,74.57 37.19,74.57 X2.C10 38.1,73.76 38.91,74.57 61.37,74.57 62.28,73.66 X3.C10 82.5,73.66 83.41,74.57 87.99,74.57 X4.C10 107.9,73.66 108.81,74.57 113.39,74.57 X5.C10 114.3,73.76 115.11,74.57 137.57,74.57 138.48,73.66 X6.C10 140.61,74.57 162.97,74.57 163.88,73.66 X7.C10
SIG21
  Top 0.152: X1.A11 8.84,71.12 9.75,70.21 32.11,70.21 X2.A11 33.02,71.02 33.83,70.21 38.51,70.21 39.42,71.12 X3.A11 | X5.A11 110.13,70.21 114.71,70.21 115.62,71.12 X6.A11 135.53,70.21 140.11,70.21 141.02,71.12 X7.A11
  Bottom 0.152: X3.A11 59.33,70.21 63.91,70.21 64.82,71.12 X4.A11 84.73,70.21 89.31,70.21 90.22,71.12 X5.A11
SIG22
  Top 0.152: X4.B11 85.14,71.12 84.23,70.21 61.87,70.21 X3.B11
  Bottom 0.152: X1.B11 11.38,71.12 12.29,72.03 34.65,72.03 X2.B11 35.56,71.22 36.37,72.03 58.83,72.03 59.74,71.12 X3.B11 | X4.B11 87.27,72.03 109.63,72.03 110.54,71.12 X5.B11 112.67,72.03 135.03,72.03 135.94,71.12 X6.B11 138.07,72.03 160.43,72.03 161.34,71.12 X7.B11
SIG23
  Top 0.152: X1.C11 31.7,71.12 32.61,72.03 37.19,72.03 X2.C11 38.1,71.22 38.91,72.03 61.37,72.03 62.28,71.12 X3.C11 82.5,71.12 83.41,72.03 87.99,72.03 X4.C11 107.9,71.12 108.81,72.03 113.39,72.03 X5.C11 114.3,71.22 115.11,72.03 137.57,72.03 138.48,71.12 X6.C11 140.61,72.03 162.97,72.03 163.88,71.12 X7.C11
SIG24
  Top 0.152: X1.A12 8.84,68.58 9.75,67.67 32.11,67.67 X2.A12 33.02,68.48 33.83,67.67 38.51,67.67 39.42,68.58 X3.A12 | X5.A12 110.13,67.67 114.71,67.67 115.62,68.58 X6.A12 135.53,67.67 140.11,67.67 141.02,68.58 X7.A12
  Bottom 0.152: X3.A12 59.33,67.67 63.91,67.67 64.82,68.58 X4.A12 84.73,67.67 89.31,67.67 90.22,68.58 X5.A12
SIG25
  Top 0.152: X4.B12 85.14,68.58 84.23,67.67 61.87,67.67 X3.B12
  Bottom 0.152: X1.B12 11.38,68.58 12.29,69.49 34.65,69.49 X2.B12 35.56,68.68 36.37,69.49 58.83,69.49 59.74,68.58 X3.B12 | X4.B12 87.27,69.49 109.63,69.49 110.54,68.58 X5.B12 112.67,69.49 135.03,69.49 135.94,68.58 X6.B12 138.07,69.49 160.43,69.49 161.34,68.58 X7.B12
SIG26
  Top 0.152: X1.C12 31.7,68.58 32.61,69.49 37.19,69.49 X2.C12 38.1,68.68 38.91,69.49 61.37,69.49 62.28,68.58 X3.C12 82.5,68.58 83.41,69.49 87.99,69.49 X4.C12 107.9,68.58 108.81,69.49 113.39,69.49 X5.C12 114.3,68.68 115.11,69.49 137.57,69.49 138.48,68.58 X6.C12 140.61,69.49 162.97,69.49 163.88,68.58 X7.C12
SIG27
  Top 0.152: X7.A13 141.02,66.04 140.11,65.13 135.43,65.13 134.62,65.94 X6.A13 133.71,65.13 111.35,65.13 110.44,66.04 X5.A13 108.51,66.04 107.59,65.13 84.73,65.13 X4.A13 64.82,66.04 63.91,65.13 59.33,65.13 X3.A13 39.42,66.04 38.51,65.13 33.83,65.13 33.02,65.94 X2.A13 32.11,65.13 9.75,65.13 8.84,66.04 X1.A13
SIG28
  Bottom 0.152: X1.B13 11.38,66.04 12.29,66.95 34.65,66.95 X2.B13 35.56,66.14 36.37,66.95 58.83,66.95 59.74,66.04 X3.B13 61.87,65.13 84.23,65.13 85.14,66.04 X4.B13 87.27,65.13 109.63,65.13 110.54,66.04 X5.B13 112.67,66.95 135.03,66.95 135.94,66.04 X6.B13 138.07,66.95 160.43,66.95 161.34,66.04 X7.B13
SIG29
  Top 0.152: X1.C13 31.7,66.04 32.61,66.95 37.19,66.95 X2.C13 38.1,66.14 38.91,66.95 61.37,66.95 62.28,66.04 X3.C13 | X4.C13 107.9,66.04 108.81,66.95 113.39,66.95 X5.C13 114.3,66.14 115.11,66.95 137.57,66.95 138.48,66.04 X6.C13 140.61,66.95 162.97,66.95 163.88,66.04 X7.C13
  Bottom 0.152: X3.C13 82.5,66.04 83.41,66.95 87.99,66.95 X4.C13
SIG30
  Top 0.152: X1.A14 8.84,63.5 9.75,62.59 32.11,62.59 X2.A14 33.02,63.4 33.83,62.59 38.51,62.59 39.42,63.5 X3.A14 59.33,62.59 63.91,62.59 64.82,63.5 X4.A14 | X5.A14 110.13,62.59 114.71,62.59 115.62,63.5 X6.A14 135.53,62.59 140.11,62.59 141.02,63.5 X7.A14
  Bottom 0.152: X5.A14 90.22,63.5 89.31,62.59 84.73,62.59 X4.A14
SIG31
  Bottom 0.152: X1.B14 11.38,63.5 12.29,64.41 34.65,64.41 X2.B14 35.56,63.6 36.37,64.41 58.83,64.41 59.74,63.5 X3.B14 61.87,64.41 84.23,64.41 85.14,63.5 X4.B14 87.27,64.41 109.63,64.41 110.54,63.5 X5.B14 112.67,64.41 135.03,64.41 135.94,63.5 X6.B14 138.07,64.41 160.43,64.41 161.34,63.5 X7.B14
SIG32
  Top 0.152: X1.C14 31.7,63.5 32.61,64.41 37.19,64.41 X2.C14 38.1,63.6 38.91,64.41 61.37,64.41 62.28,63.5 X3.C14 64.21,63.5 65.13,64.41 87.99,64.41 X4.C14 107.9,63.5 108.81,64.41 113.39,64.41 X5.C14 114.3,63.6 115.11,64.41 137.57,64.41 138.48,63.5 X6.C14 140.61,64.41 162.97,64.41 163.88,63.5 X7.C14
SIG33
  Top 0.152: X7.A15 141.02,60.96 140.11,60.05 135.43,60.05 134.62,60.86 X6.A15 133.71,60.05 111.35,60.05 110.44,60.96 X5.A15 108.51,60.96 107.59,60.05 84.73,60.05 X4.A15 | X1.A15 8.84,60.96 9.75,60.05 32.11,60.05 X2.A15 33.02,60.86 33.83,60.05 38.51,60.05 39.42,60.96 X3.A15
  Bottom 0.152: X4.A15 64.82,60.96 63.91,61.87 59.33,61.87 X3.A15
SIG34
  Bottom 0.152: X1.B15 11.38,60.96 12.29,61.87 34.65,61.87 X2.B15 36.47,60.05 58.83,60.05 59.74,60.96 X3.B15 61.87,60.05 84.23,60.05 85.14,60.96 X4.B15 87.27,61.87 109.63,61.87 110.54,60.96 X5.B15 112.67,61.87 135.03,61.87 135.94,60.96 X6.B15 138.07,61.87 160.43,61.87 161.34,60.96 X7.B15
SIG35
  Top 0.152: X1.C15 31.7,60.96 32.61,61.87 37.19,61.87 X2.C15 38.1,61.06 38.91,61.87 61.37,61.87 62.28,60.96 X3.C15 82.5,60.96 83.41,61.87 87.99,61.87 X4.C15 107.9,60.96 108.81,61.87 113.39,61.87 X5.C15 114.3,61.06 115.11,61.87 137.57,61.87 138.48,60.96 X6.C15 140.61,61.87 162.97,61.87 163.88,60.96 X7.C15
SIG36
  Top 0.152: X7.A16 141.02,58.42 140.11,57.51 135.43,57.51 134.62,58.32 X6.A16 133.71,57.51 111.35,57.51 110.44,58.42 X5.A16 108.51,58.42 107.59,57.51 84.73,57.51 X4.A16 64.82,58.42 63.91,57.51 59.33,57.51 X3.A16 39.42,58.42 38.51,57.51 33.83,57.51 33.02,58.32 X2.A16 32.11,57.51 9.75,57.51 8.84,58.42 X1.A16
SIG37
  Bottom 0.152: X1.B16 11.38,58.42 12.29,59.33 34.65,59.33 X2.B16 35.56,58.52 36.37,59.33 58.83,59.33 59.74,58.42 X3.B16 61.87,59.33 84.23,59.33 85.14,58.42 X4.B16 87.27,59.33 109.63,59.33 110.54,58.42 X5.B16 112.67,59.33 135.03,59.33 135.94,58.42 X6.B16 138.07,59.33 160.43,59.33 161.34,58.42 X7.B16
SIG38
  Top 0.152: X1.C16 31.7,58.42 32.61,59.33 37.19,59.33 X2.C16 38.1,58.52 38.91,59.33 61.37,59.33 62.28,58.42 X3.C16 | X4.C16 107.9,58.42 108.81,59.33 113.39,59.33 X5.C16 114.3,58.52 115.11,59.33 137.57,59.33 138.48,58.42 X6.C16 140.61,59.33 162.97,59.33 163.88,58.42 X7.C16
  Bottom 0.152: X3.C16 82.5,58.42 83.41,57.51 87.99,57.51 X4.C16
SIG39
  Top 0.152: X1.A17 8.84,55.88 9.75,54.97 32.11,54.97 X2.A17 33.02,55.78 33.83,54.97 38.51,54.97 39.42,55.88 X3.A17 59.33,54.97 63.91,54.97 64.82,55.88 X4.A17 | X6.A17 115.62,55.88 114.71,54.97 110.13,54.97 X5.A17
  Bottom 0.152: X5.A17 90.22,55.88 89.31,54.97 84.73,54.97 X4.A17 | X7.A17 141.02,55.88 140.11,54.97 135.53,54.97 X6.A17
SIG40
  Top 0.152: X7.B17 161.34,55.88 160.43,54.97 138.07,54.97 X6.B17
  Bottom 0.152: X1.B17 11.38,55.88 12.29,56.79 34.65,56.79 X2.B17 35.56,55.98 36.37,56.79 58.83,56.79 59.74,55.88 X3.B17 61.87,56.79 84.23,56.79 85.14,55.88 X4.B17 87.27,56.79 109.63,56.79 110.54,55.88 X5.B17 112.67,56.79 135.03,56.79 135.94,55.88 X6.B17
SIG41
  Top 0.152: X1.C17 31.7,55.88 32.61,56.79 37.19,56.79 X2.C17 38.1,55.98 38.91,56.79 61.37,56.79 62.28,55.88 X3.C17 64.21,55.88 65.13,56.79 87.99,56.79 X4.C17 107.9,55.88 108.81,56.79 113.39,56.79 X5.C17 114.3,55.98 115.11,56.79 137.57,56.79 138.48,55.88 X6.C17 140.61,56.79 162.97,56.79 163.88,55.88 X7.C17
SIG42
  Top 0.152: X7.A18 141.02,53.34 140.11,52.43 135.43,52.43 134.62,53.24 X6.A18 133.71,52.43 111.35,52.43 110.44,53.34 X5.A18 108.51,53.34 107.59,52.43 84.73,52.43 X4.A18 64.82,53.34 63.91,52.43 59.33,52.43 X3.A18 39.42,53.34 38.51,52.43 33.83,52.43 33.02,53.24 X2.A18 32.11,52.43 9.75,52.43 8.84,53.34 X1.A18
SIG43
  Bottom 0.152: X1.B18 11.38,53.34 12.29,54.25 34.65,54.25 X2.B18 35.56,53.44 36.37,54.25 58.83,54.25 59.74,53.34 X3.B18 61.87,54.25 84.23,54.25 85.14,53.34 X4.B18 87.27,54.25 109.63,54.25 110.54,53.34 X5.B18 112.67,54.25 135.03,54.25 135.94,53.34 X6.B18 138.07,54.25 160.43,54.25 161.34,53.34 X7.B18
SIG44
  Top 0.152: X1.C18 31.7,53.34 32.61,54.25 37.19,54.25 X2.C18 38.1,53.44 38.91,54.25 61.37,54.25 62.28,53.34 X3.C18 | X4.C18 107.9,53.34 108.81,54.25 113.39,54.25 X5.C18 114.3,53.44 115.11,54.25 137.57,54.25 138.48,53.34 X6.C18 140.61,54.25 162.97,54.25 163.88,53.34 X7.C18
  Bottom 0.152: X3.C18 82.5,53.34 83.41,52.43 87.99,52.43 X4.C18
SIG45
  Top 0.152: X7.A19 141.02,50.8 140.11,49.89 135.43,49.89 134.62,50.7 X6.A19 133.71,49.89 111.35,49.89 110.44,50.8 X5.A19 108.51,50.8 107.59,49.89 84.73,49.89 X4.A19 64.82,50.8 63.91,49.89 59.33,49.89 X3.A19 39.42,50.8 38.51,49.89 33.83,49.89 33.02,50.7 X2.A19 32.11,49.89 9.75,49.89 8.84,50.8 X1.A19
SIG46
  Bottom 0.152: X1.B19 11.38,50.8 12.29,51.71 34.65,51.71 X2.B19 35.56,50.9 36.37,51.71 58.83,51.71 59.74,50.8 X3.B19 61.87,49.89 84.23,49.89 85.14,50.8 X4.B19 87.27,49.89 109.63,49.89 110.54,50.8 X5.B19 112.67,51.71 135.03,51.71 135.94,50.8 X6.B19 138.07,51.71 160.43,51.71 161.34,50.8 X7.B19
SIG47
  Top 0.152: X1.C19 31.7,50.8 32.61,51.71 37.19,51.71 X2.C19 38.1,50.9 38.91,51.71 61.37,51.71 62.28,50.8 X3.C19 | X4.C19 107.9,50.8 108.81,51.71 113.39,51.71 X5.C19 114.3,50.9 115.11,51.71 137.57,51.71 138.48,50.8 X6.C19 140.61,51.71 162.97,51.71 163.88,50.8 X7.C19
  Bottom 0.152: X3.C19 82.5,50.8 83.41,51.71 87.99,51.71 X4.C19
SIG48
  Top 0.152: X1.A20 8.84,48.26 9.75,47.35 32.11,47.35 X2.A20 33.02,48.16 33.83,47.35 38.51,47.35 39.42,48.26 X3.A20 59.33,47.35 63.91,47.35 64.82,48.26 X4.A20 | X5.A20 110.13,47.35 114.71,47.35 115.62,48.26 X6.A20 135.53,47.35 140.11,47.35 141.02,48.26 X7.A20
  Bottom 0.152: X5.A20 90.22,48.26 89.31,47.35 84.73,47.35 X4.A20
SIG49
  Bottom 0.152: X1.B20 11.38,48.26 12.29,49.17 34.65,49.17 X2.B20 35.56,48.36 36.37,49.17 58.83,49.17 59.74,48.26 X3.B20 61.87,49.17 84.23,49.17 85.14,48.26 X4.B20 87.27,49.17 109.63,49.17 110.54,48.26 X5.B20 112.67,49.17 135.03,49.17 135.94,48.26 X6.B20 138.07,49.17 160.43,49.17 161.34,48.26 X7.B20
SIG50
  Top 0.152: X1.C20 31.7,48.26 32.61,49.17 37.19,49.17 X2.C20 38.1,48.36 38.91,49.17 61.37,49.17 62.28,48.26 X3.C20 64.21,48.26 65.13,49.17 87.99,49.17 X4.C20 107.9,48.26 108.81,49.17 113.39,49.17 X5.C20 114.3,48.36 115.11,49.17 137.57,49.17 138.48,48.26 X6.C20 140.61,49.17 162.97,49.17 163.88,48.26 X7.C20
SIG51
  Top 0.152: X1.A21 8.84,45.72 9.75,44.81 32.11,44.81 X2.A21 33.02,45.62 33.83,44.81 38.51,44.81 39.42,45.72 X3.A21 | X5.A21 110.13,44.81 114.71,44.81 115.62,45.72 X6.A21 135.53,44.81 140.11,44.81 141.02,45.72 X7.A21
  Bottom 0.152: X3.A21 59.33,44.81 63.91,44.81 64.82,45.72 X4.A21 84.73,44.81 89.31,44.81 90.22,45.72 X5.A21
SIG52
  Top 0.152: X4.B21 85.14,45.72 84.23,44.81 61.87,44.81 X3.B21
  Bottom 0.152: X1.B21 11.38,45.72 12.29,46.63 34.65,46.63 X2.B21 35.56,45.82 36.37,46.63 58.83,46.63 59.74,45.72 X3.B21 | X4.B21 87.27,46.63 109.63,46.63 110.54,45.72 X5.B21 112.67,46.63 135.03,46.63 135.94,45.72 X6.B21 138.07,46.63 160.43,46.63 161.34,45.72 X7.B21
SIG53
  Top 0.152: X1.C21 31.7,45.72 32.61,46.63 37.19,46.63 X2.C21 38.1,45.82 38.91,46.63 61.37,46.63 62.28,45.72 X3.C21 82.5,45.72 83.41,46.63 87.99,46.63 X4.C21 107.9,45.72 108.81,46.63 113.39,46.63 X5.C21 114.3,45.82 115.11,46.63 137.57,46.63 138.48,45.72 X6.C21 140.61,46.63 162.97,46.63 163.88,45.72 X7.C21
SIG54
  Top 0.152: X7.A22 141.02,43.18 140.11,42.27 135.43,42.27 134.62,43.08 X6.A22 133.71,42.27 111.35,42.27 110.44,43.18 X5.A22 108.51,43.18 107.59,42.27 84.73,42.27 X4.A22 64.82,43.18 63.91,42.27 59.33,42.27 X3.A22 39.42,43.18 38.51,42.27 33.83,42.27 33.02,43.08 X2.A22 32.11,42.27 9.75,42.27 8.84,43.18 X1.A22
SIG55
  Bottom 0.152: X1.B22 11.38,43.18 12.29,44.09 34.65,44.09 X2.B22 35.56,43.28 36.37,44.09 58.83,44.09 59.74,43.18 X3.B22 61.87,44.09 84.23,44.09 85.14,43.18 X4.B22 87.27,44.09 109.63,44.09 110.54,43.18 X5.B22 112.67,44.09 135.03,44.09 135.94,43.18 X6.B22 138.07,44.09 160.43,44.09 161.34,43.18 X7.B22
SIG56
  Top 0.152: X1.C22 31.7,43.18 32.61,44.09 37.19,44.09 X2.C22 38.1,43.28 38.91,44.09 61.37,44.09 62.28,43.18 X3.C22 | X4.C22 107.9,43.18 108.81,44.09 113.39,44.09 X5.C22 114.3,43.28 115.11,44.09 137.57,44.09 138.48,43.18 X6.C22 140.61,44.09 162.97,44.09 163.88,43.18 X7.C22
  Bottom 0.152: X3.C22 82.5,43.18 83.41,42.27 87.99,42.27 X4.C22
SIG57
  Top 0.152: X1.A23 8.84,40.64 9.75,39.73 32.11,39.73 X2.A23 33.02,40.54 33.83,39.73 38.51,39.73 39.42,40.64 X3.A23 59.33,39.73 63.91,39.73 64.82,40.64 X4.A23 | X6.A23 115.62,40.64 114.71,39.73 110.13,39.73 X5.A23
  Bottom 0.152: X5.A23 90.22,40.64 89.31,39.73 84.73,39.73 X4.A23 | X7.A23 141.02,40.64 140.11,39.73 135.53,39.73 X6.A23
SIG58
  Top 0.152: X7.B23 161.34,40.64 160.43,39.73 138.07,39.73 X6.B23
  Bottom 0.152: X1.B23 11.38,40.64 12.29,41.55 34.65,41.55 X2.B23 35.56,40.74 36.37,41.55 58.83,41.55 59.74,40.64 X3.B23 61.87,41.55 84.23,41.55 85.14,40.64 X4.B23 87.27,41.55 109.63,41.55 110.54,40.64 X5.B23 112.67,41.55 135.03,41.55 135.94,40.64 X6.B23
SIG59
  Top 0.152: X1.C23 31.7,40.64 32.61,41.55 37.19,41.55 X2.C23 38.1,40.74 38.91,41.55 61.37,41.55 62.28,40.64 X3.C23 64.21,40.64 65.13,41.55 87.99,41.55 X4.C23 107.9,40.64 108.81,41.55 113.39,41.55 X5.C23 114.3,40.74 115.11,41.55 137.57,41.55 138.48,40.64 X6.C23 140.61,41.55 162.97,41.55 163.88,40.64 X7.C23
SIG60
  Top 0.152: X7.A24 141.02,38.1 140.11,37.19 135.43,37.19 134.62,38 X6.A24 133.71,37.19 111.35,37.19 110.44,38.1 X5.A24 108.51,38.1 107.59,37.19 84.73,37.19 X4.A24 64.82,38.1 63.91,37.19 59.33,37.19 X3.A24 39.42,38.1 38.51,37.19 33.83,37.19 33.02,38 X2.A24 32.11,37.19 9.75,37.19 8.84,38.1 X1.A24
SIG61
  Bottom 0.152: X1.B24 11.38,38.1 12.29,39.01 34.65,39.01 X2.B24 35.56,38.2 36.37,39.01 58.83,39.01 59.74,38.1 X3.B24 61.87,39.01 84.23,39.01 85.14,38.1 X4.B24 87.27,39.01 109.63,39.01 110.54,38.1 X5.B24 112.67,39.01 135.03,39.01 135.94,38.1 X6.B24 138.07,39.01 160.43,39.01 161.34,38.1 X7.B24
SIG62
  Top 0.152: X1.C24 31.7,38.1 32.61,39.01 37.19,39.01 X2.C24 38.1,38.2 38.91,39.01 61.37,39.01 62.28,38.1 X3.C24 | X4.C24 107.9,38.1 108.81,39.01 113.39,39.01 X5.C24 114.3,38.2 115.11,39.01 137.57,39.01 138.48,38.1 X6.C24 140.61,39.01 162.97,39.01 163.88,38.1 X7.C24
  Bottom 0.152: X3.C24 82.5,38.1 83.41,37.19 87.99,37.19 X4.C24
SIG63
  Top 0.152: X1.A25 8.84,35.56 9.75,34.65 32.11,34.65 X2.A25 33.02,35.46 33.83,34.65 38.51,34.65 39.42,35.56 X3.A25 | X7.A25 141.02,35.56 140.11,34.65 135.53,34.65 X6.A25
  Bottom 0.152: X3.A25 59.33,34.65 63.91,34.65 64.82,35.56 X4.A25 84.73,36.47 89.31,36.47 90.22,35.56 X5.A25 110.13,34.65 114.71,34.65 115.62,35.56 X6.A25
SIG64
  Top 0.152: X3.B25 61.87,34.65 84.23,34.65 85.14,35.56 X4.B25 87.27,34.65 109.63,34.65 110.54,35.56 X5.B25
  Bottom 0.152: X1.B25 11.38,35.56 12.29,36.47 34.65,36.47 X2.B25 35.56,35.66 36.37,36.47 58.83,36.47 59.74,35.56 X3.B25 | X5.B25 112.67,36.47 135.03,36.47 135.94,35.56 X6.B25 138.07,36.47 160.43,36.47 161.34,35.56 X7.B25
SIG65
  Top 0.152: X1.C25 31.7,35.56 32.61,36.47 37.19,36.47 X2.C25 38.1,35.66 38.91,36.47 61.37,36.47 62.28,35.56 X3.C25 82.5,35.56 83.41,36.47 87.99,36.47 X4.C25 107.9,35.56 108.81,36.47 113.39,36.47 X5.C25 114.3,35.66 115.11,36.47 137.57,36.47 138.48,35.56 X6.C25 140.61,36.47 162.97,36.47 163.88,35.56 X7.C25
SIG66
  Top 0.152: X1.A26 8.84,33.02 9.75,32.11 32.11,32.11 X2.A26 33.02,32.92 33.83,32.11 38.51,32.11 39.42,33.02 X3.A26 59.33,32.11 63.91,32.11 64.82,33.02 X4.A26 84.73,32.11 89.31,32.11 90.22,33.02 X5.A26 | X7.A26 141.02,33.02 140.11,32.11 135.53,32.11 X6.A26
  Bottom 0.152: X6.A26 115.62,33.02 114.71,33.93 110.13,33.93 X5.A26
SIG67
  Bottom 0.152: X1.B26 11.38,33.02 12.29,33.93 34.65,33.93 X2.B26 35.56,33.12 36.37,33.93 58.83,33.93 59.74,33.02 X3.B26 61.87,33.93 84.23,33.93 85.14,33.02 X4.B26 87.27,32.11 109.63,32.11 110.54,33.02 X5.B26 112.67,32.11 135.03,32.11 135.94,33.02 X6.B26 138.07,33.93 160.43,33.93 161.34,33.02 X7.B26
SIG68
  Top 0.152: X7.C26 163.88,33.02 162.97,33.93 140.51,33.93 139.7,33.12 X6.C26 138.79,33.93 134.21,33.93 133.3,33.02 X5.C26 113.08,33.02 112.17,33.93 89.81,33.93 X4.C26 87.68,33.02 86.77,33.93 64.41,33.93 X3.C26 62.28,33.02 61.37,33.93 38.91,33.93 38.1,33.12 X2.C26 37.19,33.93 32.61,33.93 31.7,33.02 X1.C26
SIG69
  Top 0.152: X7.A27 141.02,30.48 140.11,31.39 135.43,31.39 134.62,30.58 X6.A27 133.71,31.39 111.35,31.39 110.44,30.48 X5.A27 108.51,30.48 107.59,31.39 84.73,31.39 X4.A27 64.82,30.48 63.91,31.39 59.33,31.39 X3.A27 39.42,30.48 38.51,31.39 33.83,31.39 33.02,30.58 X2.A27 32.11,31.39 9.75,31.39 8.84,30.48 X1.A27
SIG70
  Top 0.152: X6.B27 138.38,30.48 139.29,29.57 161.65,29.57 X7.B27 | X1.B27 11.38,30.48 12.29,29.57 34.65,29.57 X2.B27 35.56,30.38 36.37,29.57 58.83,29.57 59.74,30.48 X3.B27 61.87,29.57 84.23,29.57 85.14,30.48 X4.B27
  Bottom 0.152: X4.B27 87.27,31.39 109.63,31.39 110.54,30.48 X5.B27 112.67,31.39 135.03,31.39 135.94,30.48 X6.B27
SIG71
  Top 0.152: X4.C27 107.9,30.48 108.81,29.57 113.39,29.57 X5.C27
  Bottom 0.152: X1.C27 31.7,30.48 32.61,31.39 37.19,31.39 X2.C27 38.1,30.58 38.91,31.39 61.37,31.39 62.28,30.48 X3.C27 82.5,30.48 83.41,29.57 87.99,29.57 X4.C27 | X7.C27 164.19,31.39 159.61,31.39 158.7,30.48 X6.C27 138.79,29.57 134.21,29.57 133.3,30.48 X5.C27
SIG72
  Top 0.152: X1.A28 8.84,27.94 9.75,28.85 32.11,28.85 X2.A28 33.02,28.04 33.83,28.85 38.51,28.85 39.42,27.94 X3.A28 59.33,28.85 63.91,28.85 64.82,27.94 X4.A28 84.73,28.85 89.31,28.85 90.22,27.94 X5.A28 110.13,28.85 114.71,28.85 115.62,27.94 X6.A28 135.53,28.85 140.11,28.85 141.02,27.94 X7.A28
SIG73
  Top 0.152: X4.B28 87.58,27.94 88.49,27.03 110.85,27.03 X5.B28 111.76,27.84 112.57,27.03 135.03,27.03 135.94,27.94 X6.B28 138.07,27.03 160.43,27.03 161.34,27.94 X7.B28
  Bottom 0.152: X1.B28 11.38,27.94 12.29,28.85 34.65,28.85 X2.B28 35.56,28.04 36.37,28.85 58.83,28.85 59.74,27.94 X3.B28 62.18,27.94 63.09,28.85 85.45,28.85 X4.B28
SIG74
  Top 0.152: X1.C28 31.7,27.94 32.61,27.03 37.19,27.03 X2.C28 38.1,27.84 38.91,27.03 61.37,27.03 62.28,27.94 X3.C28
  Bottom 0.152: X7.C28 163.88,27.94 162.97,28.85 140.61,28.85 X6.C28 138.48,27.94 137.57,28.85 115.11,28.85 114.3,28.04 X5.C28 113.39,28.85 108.81,28.85 107.9,27.94 X4.C28 87.99,27.03 83.41,27.03 82.5,27.94 X3.C28
SIG75
  Top 0.152: X1.A29 8.84,25.4 9.75,26.31 32.11,26.31 X2.A29 | X3.A29 59.33,26.31 63.91,26.31 64.82,25.4 X4.A29 84.73,26.31 89.31,26.31 90.22,25.4 X5.A29 110.13,26.31 114.71,26.31 115.62,25.4 X6.A29
  Bottom 0.152: X3.A29 39.42,25.4 38.51,24.49 33.93,24.49 X2.A29 | X7.A29 141.02,25.4 140.11,24.49 135.53,24.49 X6.A29
SIG76
  Top 0.152: X1.B29 11.38,25.4 12.29,24.49 34.65,24.49 X2.B29 36.78,25.4 37.69,26.31 56.19,26.31 58.01,24.49 60.05,24.49 X3.B29 | X7.B29 161.34,25.4 160.43,26.31 138.07,26.31 X6.B29
  Bottom 0.152: X3.B29 62.18,25.4 63.09,26.31 85.45,26.31 X4.B29 86.36,25.5 87.17,26.31 109.63,26.31 110.54,25.4 X5.B29 112.67,26.31 135.03,26.31 135.94,25.4 X6.B29
SIG77
  Top 0.152: X7.C29 164.19,24.49 159.61,24.49 158.7,25.4 X6.C29 138.48,25.4 137.57,24.49 115.21,24.49 X5.C29 | X2.C29 56.49,25.4 57.81,24.08 61.57,24.08 62.89,25.4 X3.C29
  Bottom 0.152: X1.C29 31.7,25.4 32.61,26.31 37.19,26.31 X2.C29 | X3.C29 82.5,25.4 83.41,24.49 87.99,24.49 X4.C29 88.9,25.3 89.71,24.49 112.17,24.49 113.08,25.4 X5.C29
SIG78
  Top 0.152: X1.A30 8.84,22.86 9.75,21.95 32.11,21.95 X2.A30 | X7.A30 141.02,22.86 140.11,23.77 135.53,23.77 X6.A30
  Bottom 0.152: X2.A30 33.93,21.95 38.51,21.95 39.42,22.86 X3.A30 59.33,21.95 63.91,21.95 64.82,22.86 X4.A30 84.73,23.77 89.31,23.77 90.22,22.86 X5.A30 110.13,23.77 114.71,23.77 115.62,22.86 X6.A30
SIG79
  Top 0.152: X3.B30 61.87,23.77 84.23,23.77 85.14,22.86 X4.B30 87.27,23.77 109.63,23.77 110.54,22.86 X5.B30 112.67,21.95 135.03,21.95 135.94,22.86 X6.B30 138.07,21.95 160.43,21.95 161.34,22.86 X7.B30
  Bottom 0.152: X1.B30 11.38,22.86 12.29,23.77 34.65,23.77 X2.B30 35.56,22.96 36.37,23.77 58.83,23.77 59.74,22.86 X3.B30
SIG80
  Top 0.152: X1.C30 31.7,22.86 32.61,23.77 37.19,23.77 X2.C30 57.1,22.86 58.01,21.95 62.59,21.95 X3.C30 82.5,22.86 83.41,21.95 87.99,21.95 X4.C30
  Bottom 0.152: X7.C30 164.19,23.77 159.61,23.77 158.7,22.86 X6.C30 138.48,22.86 137.57,21.95 115.21,21.95 X5.C30 113.08,22.86 112.17,21.95 89.81,21.95 X4.C30
SIG81
  Bottom 0.152: X1.A3 8.84,91.44 9.75,92.35 32.11,92.35 X2.A3 33.93,90.53 38.51,90.53 39.42,91.44 X3.A3 59.33,90.53 63.91,90.53 64.82,91.44 X4.A3 84.73,90.53 89.31,90.53 90.22,91.44 X5.A3 110.13,92.35 114.71,92.35 115.62,91.44 X6.A3 135.53,92.35 140.11,92.35 141.02,91.44 X7.A3
SIG82
  Top 0.152: X1.B3 11.38,91.44 12.29,90.53 34.65,90.53 X2.B3 | X3.B3 61.87,92.35 84.23,92.35 85.14,91.44 X4.B3 87.27,90.53 109.63,90.53 110.54,91.44 X5.B3 112.67,90.53 135.03,90.53 135.94,91.44 X6.B3 138.07,90.53 160.43,90.53 161.34,91.44 X7.B3
  Bottom 0.152: X3.B3 59.74,91.44 58.83,92.35 36.47,92.35 X2.B3
SIG83
  Top 0.152: X1.C3 31.7,91.44 32.61,92.35 37.19,92.35 X2.C3 39.01,90.53 61.37,90.53 62.28,91.44 X3.C3 | X4.C3 107.9,91.44 108.81,92.35 113.39,92.35 X5.C3 114.3,91.54 115.11,92.35 137.57,92.35 138.48,91.44 X6.C3 140.61,92.35 162.97,92.35 163.88,91.44 X7.C3
  Bottom 0.152: X3.C3 64.21,91.44 65.13,92.35 87.99,92.35 X4.C3

### Text on the board
tNames: YACC1 | BUS BOARD | V1.1